# Altium project Etage PIC.PrjPcb
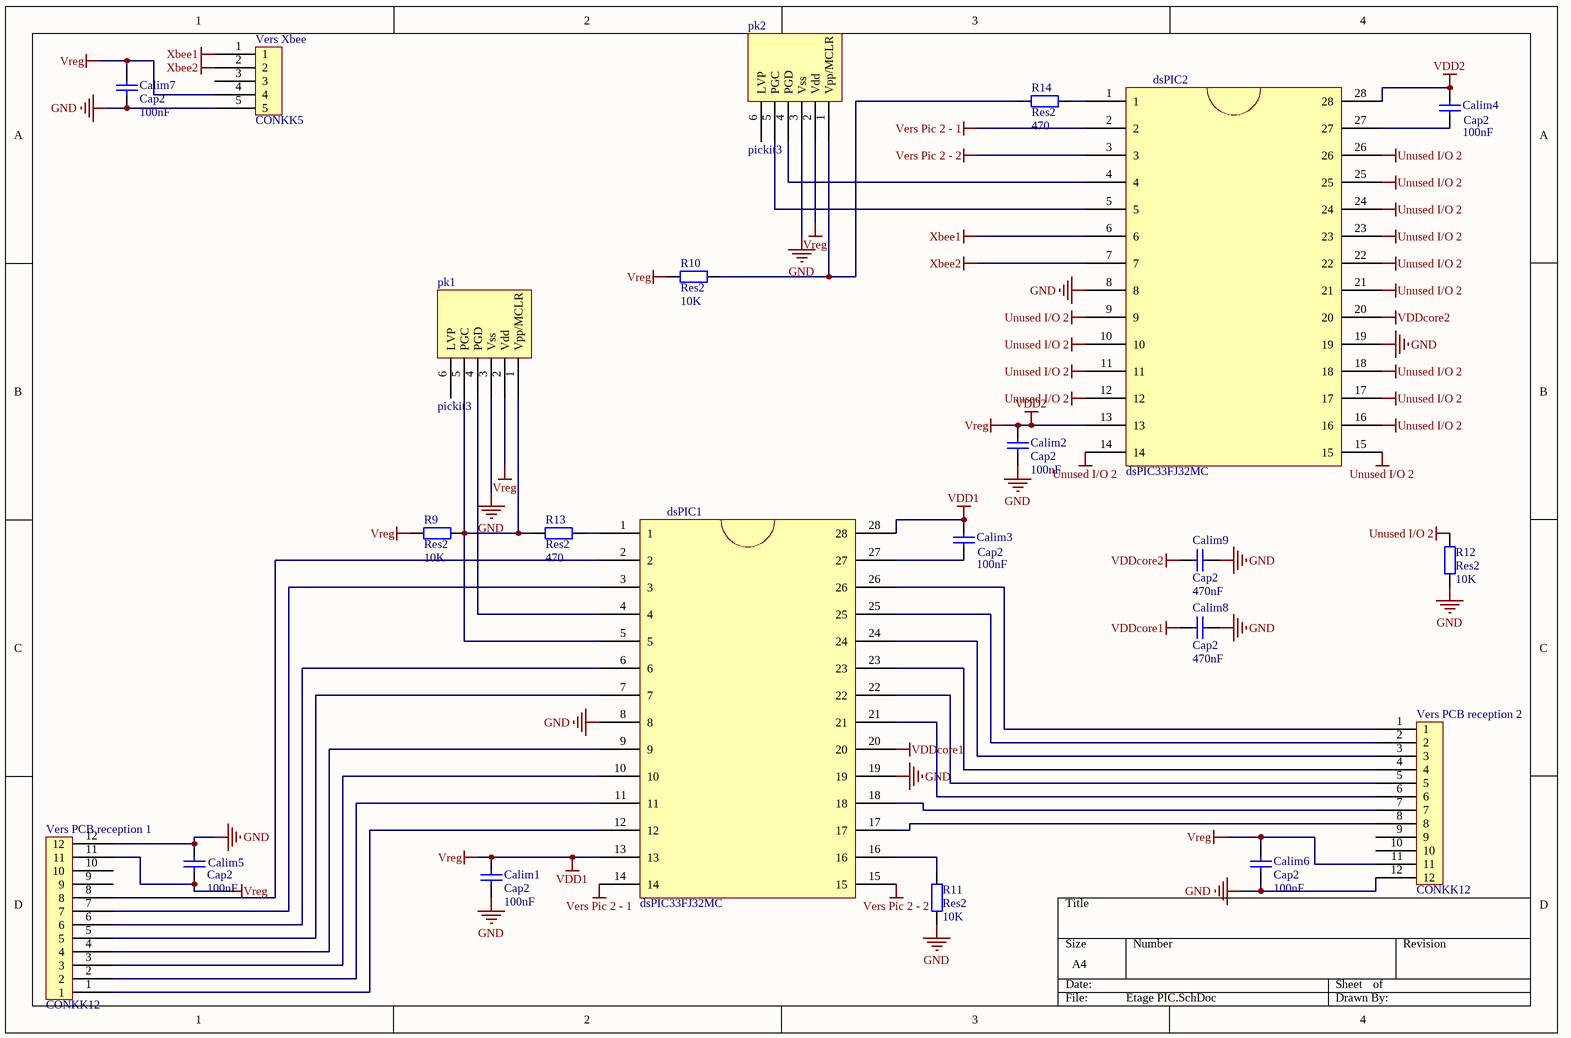
[diagram p0: Etage PIC.SchDoc]
1 sheet, 22 parts. Net scope: global (net labels, ports and power ports of the same name join across sheets).
Board file: Etage PIC.PcbDoc

## Sheet Etage PIC.SchDoc
size A4

### Parts
Calim1  Cap2  value 100nF  [CAPA2]
Calim2  Cap2  value 100nF  [CAPA2]
Calim3  Cap2  value 100nF  [CAPA2]
Calim4  Cap2  value 100nF  [CAPA2]
Calim5  Cap2  value 100nF  [CAPA2]
Calim6  Cap2  value 100nF  [CAPA2]
Calim7  Cap2  value 100nF  [CAPA2]
Calim8  Cap2  value 470nF  [CAPA2]
Calim9  Cap2  value 470nF  [CAPA2]
dsPIC1  dsPIC33FJ32MC  [PCBComponent_1]
dsPIC2  dsPIC33FJ32MC  [PCBComponent_1]
pk1  pickit3  [pickit3]
pk2  pickit3  [pickit3]
R9  Res2  value 10K  [res5_1/4W]
R10  Res2  value 10K  [res5_1/4W]
R11  Res2  value 10K  [res5_1/4W]
R12  Res2  value 10K  [res5_1/4W]
R13  Res2  value 470  [res5_1/4W]
R14  Res2  value 470  [res5_1/4W]
Vers_PCB_reception_1  CONKK12  [CONKK12]
Vers_PCB_reception_2  CONKK12  [CONKK12]
Vers_Xbee  CONKK5  [CONKK5]

### Nets
GND: Calim1.2 Calim2.2 Calim5.1 Calim6.1 Calim7.1 Calim8.2 Calim9.2 dsPIC1.8 dsPIC1.19 dsPIC2.8 dsPIC2.19 pk1.3(Vss) pk2.3(Vss) R11.1 R12.1 Vers_PCB_reception_1.12 Vers_PCB_reception_2.12 Vers_Xbee.5
Unused I/O 2: dsPIC2.9 dsPIC2.10 dsPIC2.11 dsPIC2.12 dsPIC2.14 dsPIC2.15 dsPIC2.16 dsPIC2.17 dsPIC2.18 dsPIC2.21 dsPIC2.22 dsPIC2.23 dsPIC2.24 dsPIC2.25 dsPIC2.26 R12.2
VDD1: Calim1.1 Calim2.1 Calim3.1 Calim4.1 Calim5.2 Calim6.2 Calim7.2 dsPIC1.13 dsPIC1.28 dsPIC2.13 dsPIC2.28 pk1.2(Vdd) pk2.2(Vdd) R9.1 R10.1 Vers_PCB_reception_1.11 Vers_PCB_reception_2.11 Vers_Xbee.4  [also labelled VDD2, Vreg]
VDDcore1: Calim8.1 dsPIC1.20
VDDcore2: Calim9.1 dsPIC2.20
Vers Pic 2 - 1: dsPIC1.14 dsPIC2.2
Vers Pic 2 - 2: dsPIC1.15 dsPIC2.3
Xbee1: dsPIC2.6 Vers_Xbee.1
Xbee2: dsPIC2.7 Vers_Xbee.2
NetCalim3_2: Calim3.2 dsPIC1.27
NetCalim4_2: Calim4.2 dsPIC2.27
NetdsPIC1_1: dsPIC1.1 R13.1
NetdsPIC1_2: dsPIC1.2 Vers_PCB_reception_1.8
NetdsPIC1_3: dsPIC1.3 Vers_PCB_reception_1.7
NetdsPIC1_4: dsPIC1.4 pk1.4(PGD)
NetdsPIC1_5: dsPIC1.5 pk1.1(Vpp/MCLR) pk1.5(PGC) R9.2 R13.2
NetdsPIC1_6: dsPIC1.6 Vers_PCB_reception_1.6
NetdsPIC1_7: dsPIC1.7 Vers_PCB_reception_1.5
NetdsPIC1_9: dsPIC1.9 Vers_PCB_reception_1.4
NetdsPIC1_10: dsPIC1.10 Vers_PCB_reception_1.3
NetdsPIC1_11: dsPIC1.11 Vers_PCB_reception_1.2
NetdsPIC1_12: dsPIC1.12 Vers_PCB_reception_1.1
NetdsPIC1_16: dsPIC1.16 R11.2
NetdsPIC1_17: dsPIC1.17 Vers_PCB_reception_2.8
NetdsPIC1_18: dsPIC1.18 Vers_PCB_reception_2.7
NetdsPIC1_21: dsPIC1.21 Vers_PCB_reception_2.6
NetdsPIC1_22: dsPIC1.22 Vers_PCB_reception_2.5
NetdsPIC1_23: dsPIC1.23 Vers_PCB_reception_2.4
NetdsPIC1_24: dsPIC1.24 Vers_PCB_reception_2.3
NetdsPIC1_25: dsPIC1.25 Vers_PCB_reception_2.2
NetdsPIC1_26: dsPIC1.26 Vers_PCB_reception_2.1
NetdsPIC2_1: dsPIC2.1 R14.1
NetdsPIC2_4: dsPIC2.4 pk2.4(PGD)
NetdsPIC2_5: dsPIC2.5 pk2.5(PGC)
Netpk2_1: pk2.1(Vpp/MCLR) R10.2 R14.2

Not connected (* = marked no-connect by the designer): pk1 6(LVP); pk2 6(LVP); Vers_PCB_reception_1 9 10; Vers_PCB_reception_2 9 10; Vers_Xbee 3

### Library data of the parts
Calim1-Calim9 = Cap2: Capacitor; Published: 8-Jun-2000; LatestRevisionDate: 17-Jul-2002; LatestRevisionNote: Re-released for DXP Platform.; PackageReference: RAD-0.3; Publisher: Altium Limited
R9-R14 = Res2: Resistor; Published: 8-Jun-2000; LatestRevisionDate: 17-Jul-2002; LatestRevisionNote: Re-released for DXP Platform.; PackageReference: AXIAL-0.4; Publisher: Altium Limited